# EAGLE design relay based circuit - Copy (EAGLE 7.2.0)
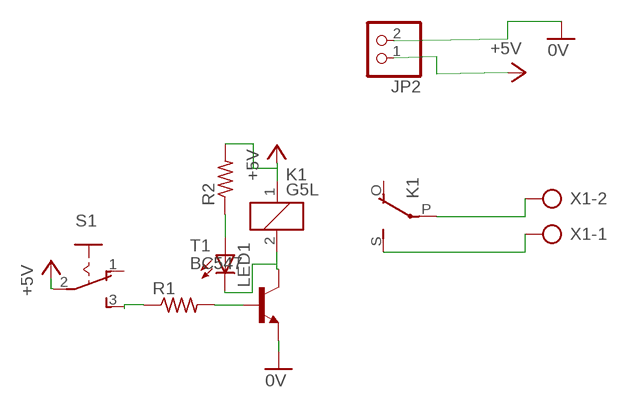
[diagram p0: schematic, sheet 1]

## Parts
JP2  PINHD-1X2  [1X02]
K1  G5L  [G5LE]
LED1  LED3MM  [LED3MM]
R1  R-US_0207/10  [0207/10]
R2  R-US_0207/10  [0207/10]
S1  M251  [M251]
T1  BC547  [TO92]
X1  AK500/2  [AK500/2]

## Nets
0V: JP2.2 T1.1(E)
+5V: JP2.1 K1.1 R2.2 S1.2(P)
N$1: R1.2 T1.2(B)
N$2: K1.P(2:P) X1.2
N$3: K1.S(2:S) X1.1
N$4: K1.2 LED1.K(C) T1.3(C)
N$5: R1.1 S1.3(S)
N$6: LED1.A R2.1
Unconnected: K1.O(2:O) S1.1(O)

## Library data of the parts
JP2 = pinhead:PINHD-1X2: PIN HEADER
K1 = relay:G5L: RELAY 1 x switch, 10 A/120 V AC, 8 A/30 V ADC, Omron; OC_FARNELL: unknown; OC_NEWARK: unknown
LED1 = led:LED: LED OSRAM: - CHIPLED LG R971, LG N971, LY N971, LG Q971, LY Q971, LO R971, LY R971 LH N974, LH R974 LS Q976, LO Q976, LY Q976 LO Q996 - Hyper CHIPLED LW Q18S LB Q993, LB Q99A, LB R99A - SideLED LS A670, LO A670, LY A670, LG A670, LP A670 LB A673, LV A673, LT A673, LW A673 LH A674 LY A675 LS A676, LA A676, LO A676, LY A676, LW A676 LS A679, LY A679, LG A679 - Hyper Micro SIDELED® LS Y876, LA Y876, LO Y876, LY Y876 LT Y87S - SmartLED LW L88C, LW L88S LB L89C, LB L89S, LG L890 LS L89K, LO L89K, LY L89K LS L896, LA L896, LO L896, LY L896 - TOPLED LS T670, LO T670, LY T670, LG T670, LP T670 LSG T670, LSP T670, LSY T670, LOP T670, LYG T670 LG T671, LOG T671, LSG T671 LB T673, LV T673, LT T673, LW T673 LH T674 LS T676, LA T676, LO T676, LY T676, LB T676, LH T676, LSB T676, LW T676 LB T67C, LV T67C, LT T67C, LS T67K, LO T67K, LY T67K, LW E67C LS E67B, LA E67B, LO E67B, LY E67B, LB E67C, LV E67C, LT E67C LW T67C LS T679, LY T679, LG T679 LS T770, LO T770, LY T770, LG T770, LP T770 LB T773, LV T773, LT T773, LW T773 LH T774 LS E675, LA E675, LY E675, LS T675 LS T776, LA T776, LO T776, LY T776, LB T776 LHGB T686 LT T68C, LB T68C - Hyper Mini TOPLED® LB M676 - Mini TOPLED Santana® LG M470 LS M47K, LO M47K, LY M47K Source: http://www.osram.convergy.de LUXEON: - LUMILED® LXK2-PW12-R00, LXK2-PW12-S00, LXK2-PW14-U00, LXK2-PW14-V00 LXK2-PM12-R00, LXK2-PM12-S00, LXK2-PM14-U00 LXK2-PE12-Q00, LXK2-PE12-R00, LXK2-PE12-S00, LXK2-PE14-T00, LXK2-PE14-U00 LXK2-PB12-K00, LXK2-PB12-L00, LXK2-PB12-M00, LXK2-PB14-N00, LXK2-PB14-P00, LXK2-PB14-Q00 LXK2-PR12-L00, LXK2-PR12-M00, LXK2-PR14-Q00, LXK2-PR14-R00 LXK2-PD12-Q00, LXK2-PD12-R00, LXK2-PD12-S00 LXK2-PH12-R00, LXK2-PH12-S00 LXK2-PL12-P00, LXK2-PL12-Q00, LXK2-PL12-R00 Source: www.luxeon.com KINGBRIGHT: KA-3528ASYC Source: www.kingbright.com
R1 R2 = rcl:R-US_: RESISTOR, American symbol
S1 = switch:M251: SLIDING SWITCH Mors, distributor Buerklin, 11G702
T1 = transistor:BC547: NPN TRANSISTOR
X1 = con-ptr500:AK500/2: CONNECTOR; OC_FARNELL: unknown; OC_NEWARK: unknown

## Board
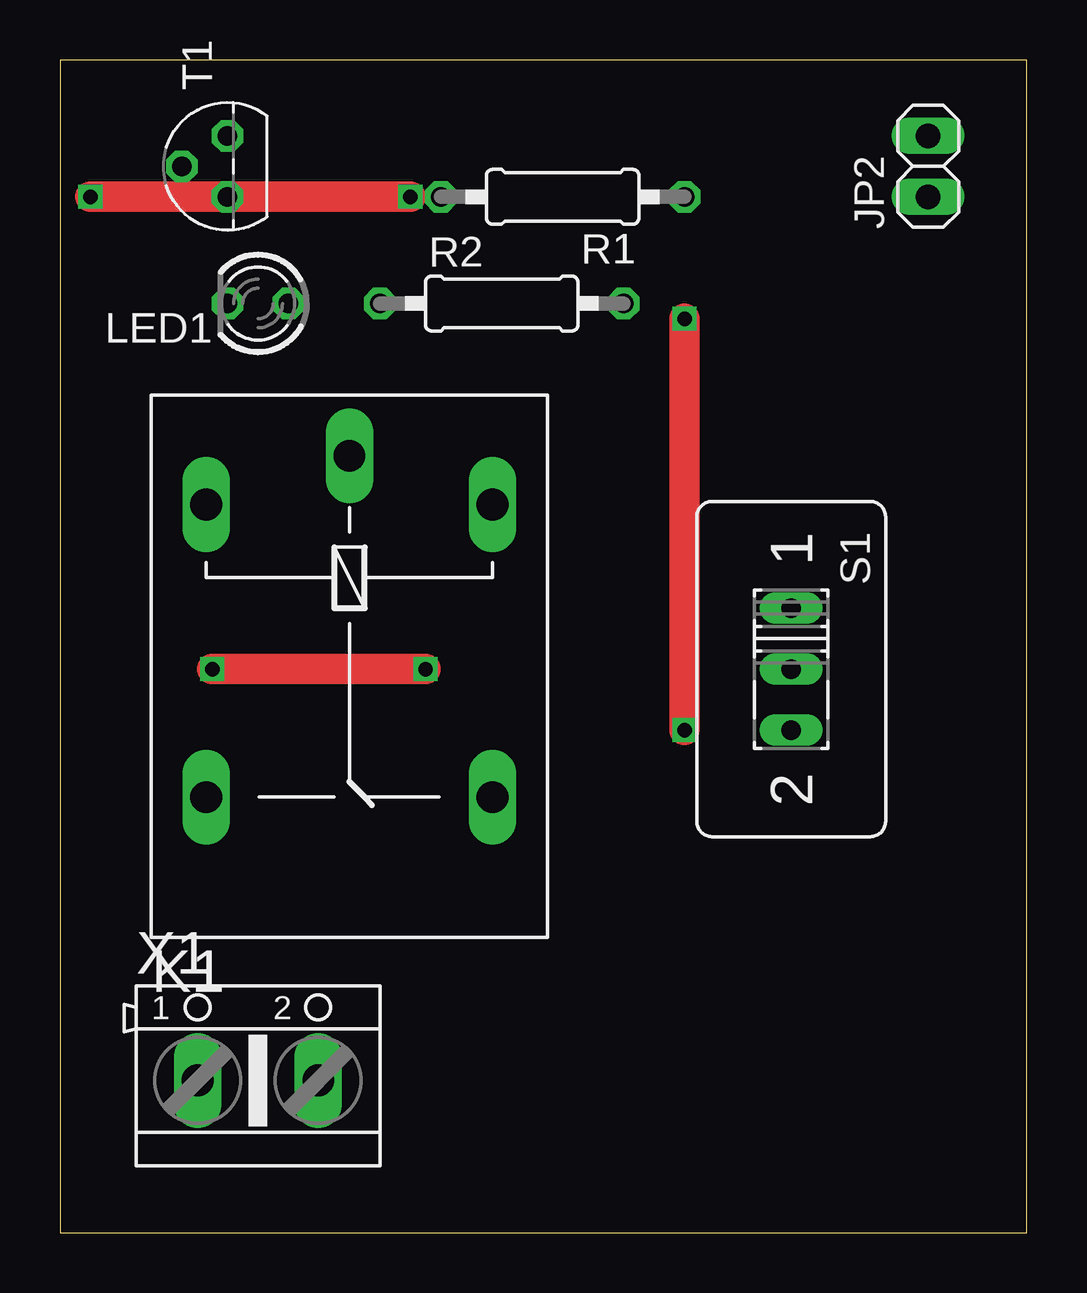
[diagram p1: board, top side]
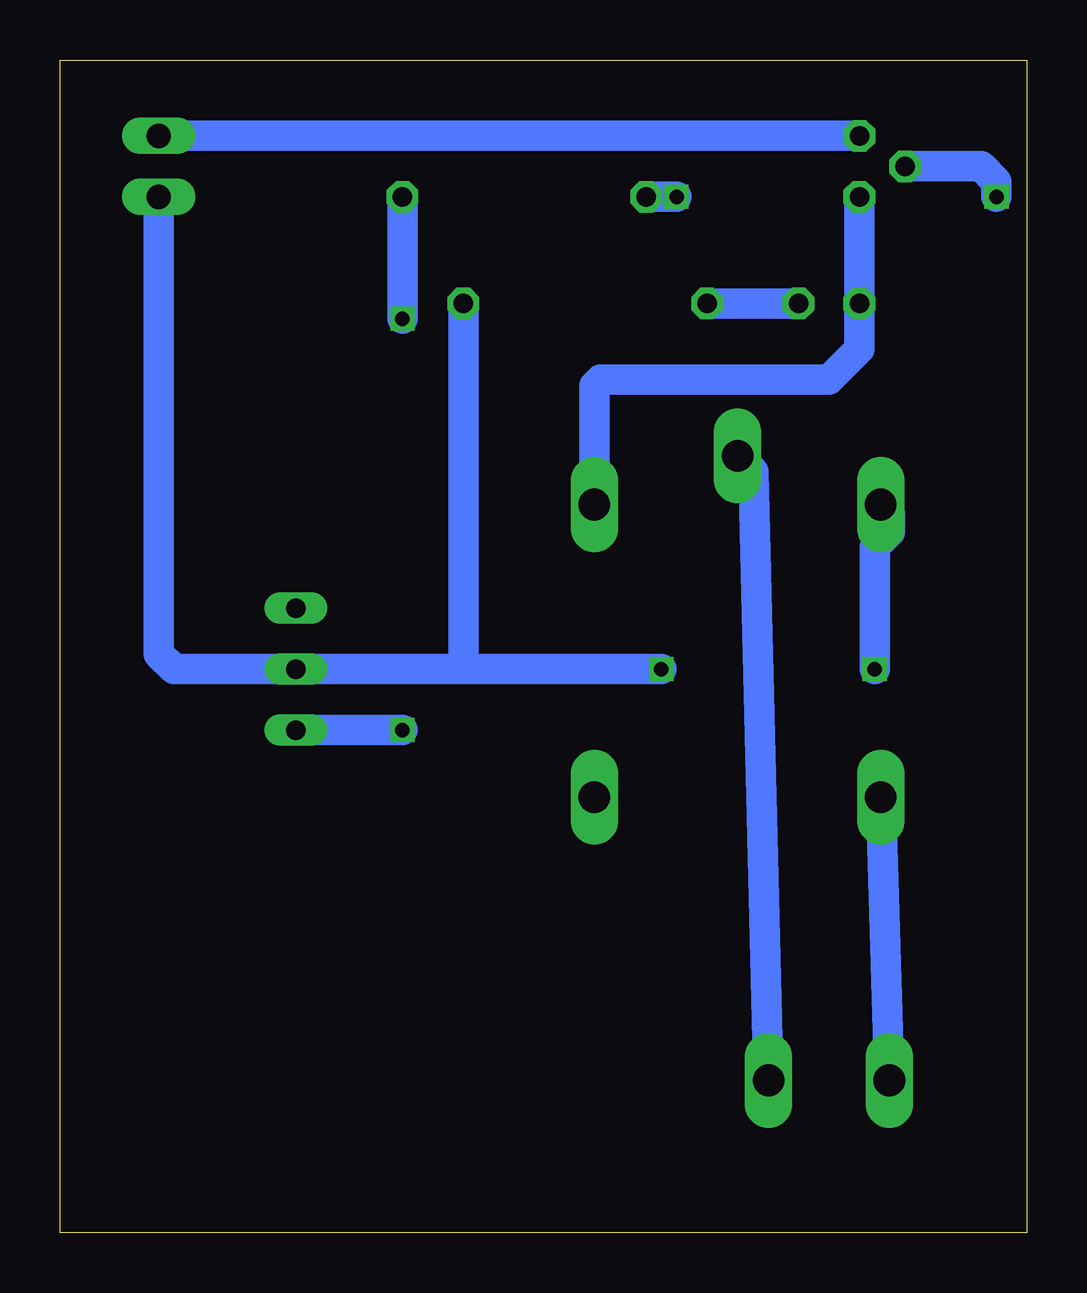
[diagram p2: board, bottom side, seen from below]

Size 40.31 x 48.88 mm. Coordinates in mm from the lower left corner, seen from the top.
Outline: 0,0 40.31,0 40.31,48.88 0,48.88 0,0
Copper layers (1*16): Top 0.035mm / dielectric 1.5mm / Bottom 0.035mm
Design rules "default": minimum track width 10mil, minimum drill 24mil, track to track 8mil, track to pad 8mil, pad to pad 8mil, via to via 8mil, smd to smd 8mil, copper to edge 40mil, drill to drill 8mil, minimum pad ring 10mil, minimum via ring 8mil, stop-mask expansion 4mil, vias tented up to drill 0mil, thermal gap 10mil

### Footprints (pad centres in the part's own frame; a part is rotated, then mirrored left to right if it is on the bottom)
1X02 = drill 1.016 long: 1 -1.27,0; 2 1.27,0
G5LE = drill 1.321 long: 1 -7.493,-5.969; 2 -7.493,5.969; O 4.699,5.969; P -9.525,0; S 4.699,-5.969
LED3MM = drill 0.813 octagon: A -1.27,0; K 1.27,0
0207/10 = drill 0.813 octagon: 1 -5.08,0; 2 5.08,0
M251 = drill 0.813 long: 1 -2.54,0; 2 0,0; 3 2.54,0
TO92 = drill 0.813 octagon: 1 1.27,0; 2 0,1.905; 3 -1.27,0
AK500/2 = drill 1.321 long: 1 -2.515,0; 2 2.515,0

### Placement (x,y rotation side)
JP2  36.2,44.45 90 top
K1  12.06,22.86 270 top
LED1  8.26,38.73 180 top
R1  20.95,43.18 180 top
R2  18.41,38.73 0 top
S1  30.48,23.5 270 top
T1  6.99,44.45 90 top
X1  8.26,6.35 0 top

### Tracks (layer width: path | path; a pad name or v marks a point on that pad's centre or on a via)
0V
  Bottom 1.27: JP2.2 T1.1
+5V  (via drill 0.6)
  Top 1.27: v15.24,23.5 v6.35,23.5
  Bottom 1.27: 23.5,23.5 S1.2 35.56,23.5 36.2,24.13 JP2.1 | 23.5,23.5 v15.24,23.5 | v6.35,23.5 6.35,28.57 5.71,29.21 5.71,29.97 K1.1 | R2.2 23.5,23.5
N$1  (via drill 0.6)
  Top 1.27: v1.27,43.18 1.91,43.18 2.54,43.18 v14.61,43.18
  Bottom 1.27: T1.2 1.91,44.45 1.27,43.81 v1.27,43.18 | R1.2 v14.61,43.18
N$2
  Bottom 1.27: X1.2 11.4,31.73 K1.P
N$3
  Bottom 1.27: X1.1 K1.S
N$4
  Bottom 1.27: T1.3 LED1.K 6.99,36.83 8.26,35.56 17.78,35.56 18.03,35.31 K1.2
N$5  (via drill 0.6)
  Top 1.27: v26.04,20.96 v26.04,38.1
  Bottom 1.27: S1.3 v26.04,20.96 | v26.04,38.1 R1.1
N$6
  Bottom 1.27: R2.1 LED1.A